# Altium schematic sheet pmosfet.SchDoc: DE:TMP:11:UC:EXPANDIDO
size 101 x 76 mm; Date: 21-07-2022; SheetNumber: 1; SheetTotal: 1; WebFGR: www.abebashop.com; VersionFGR: 20220721; PageSetup: Record=PageOptions|CenterHorizontal=True|CenterVertical=True|PrintScale=0.94|XCorrection=1.00|YCorrection=1.00|PrintKind=0|BorderSize=5000000|LeftOffset=0|BottomOffset=0|Orientation=2|PaperLength=1000|PaperWidth=1000|Scale=100|PaperSource=7|PrintQuality=-4|MediaType=1|DitherType=10|PaperKind=Letter|PrintScaleMode=1
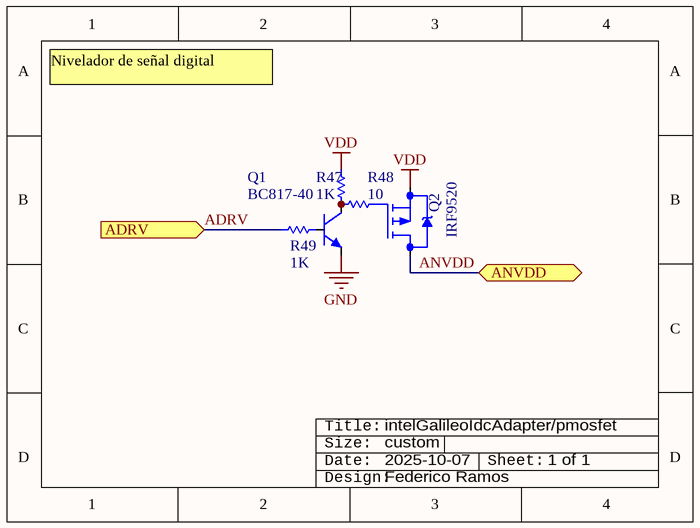
[diagram p0: pmosfet.SchDoc]

## Parts
Q1  BC817-40  [SOT23]
Q2  IRF9520  [TO220]
R47  Resistencia: 1K  [R1206]  (hidden comment: Resistencia 1206; 1Kohm)
R48  Resistencia: 10  [R1206]  (hidden comment: Resistencia 1206; 10ohm)
R49  Resistencia: 1K  [res300th]  (hidden comment: Resistencia 1206; 1Kohm)
ROT?  Rotulo_empty  (value not drawn)  (graphical)

## Ports
ADRV (in), ANVDD

## Nets
GND: Q1.2(E)
VDD: Q2.3(S) R47.2
ADRV: R49.1 ; port ADRV
ANVDD: Q2.2(D) ; port ANVDD
NetQ1_1: Q1.1(B) R49.2
NetQ1_3: Q1.3(C) R47.1 R48.1
NetQ2_1: Q2.1(G) R48.2

## Notes on the sheet
- Nivelador de señal digital
- (near ROT?) intelGalileoIdcAdapter/pmosfet
- custom
- 2025-10-07
- (near ROT?) 1 of 1
- Federico Ramos
- (in symbol Rotulo_empty) Title:; Size:; Date:; Sheet:; Design:

## Library data of the parts
Q1 = BC817-40: Dolares Elemon: 0.03755; Codigo Elemon: TR1723021
Q2 = IRF9530: 100V  12A 0.3 ohm Power Field Effect Transistor; Revision: 17-Jul-2002: Re-released for DXP Platform.
R47 R49 = Resistencia 1206; 1Kohm: Codigo Elemon: RS3886185; Dolares Elemon: 0.00720
R48 = Resistencia 1206; 10ohm: Codigo Elemon: RS3886070; Dolares Elemon: 0.00717
ROT? = Rotulo_empty: Rotulo [consolas]